# Altium schematic sheet mcu.SchDoc
size 762 x 508 mm; SheetNumber: 5; SheetTotal: 7
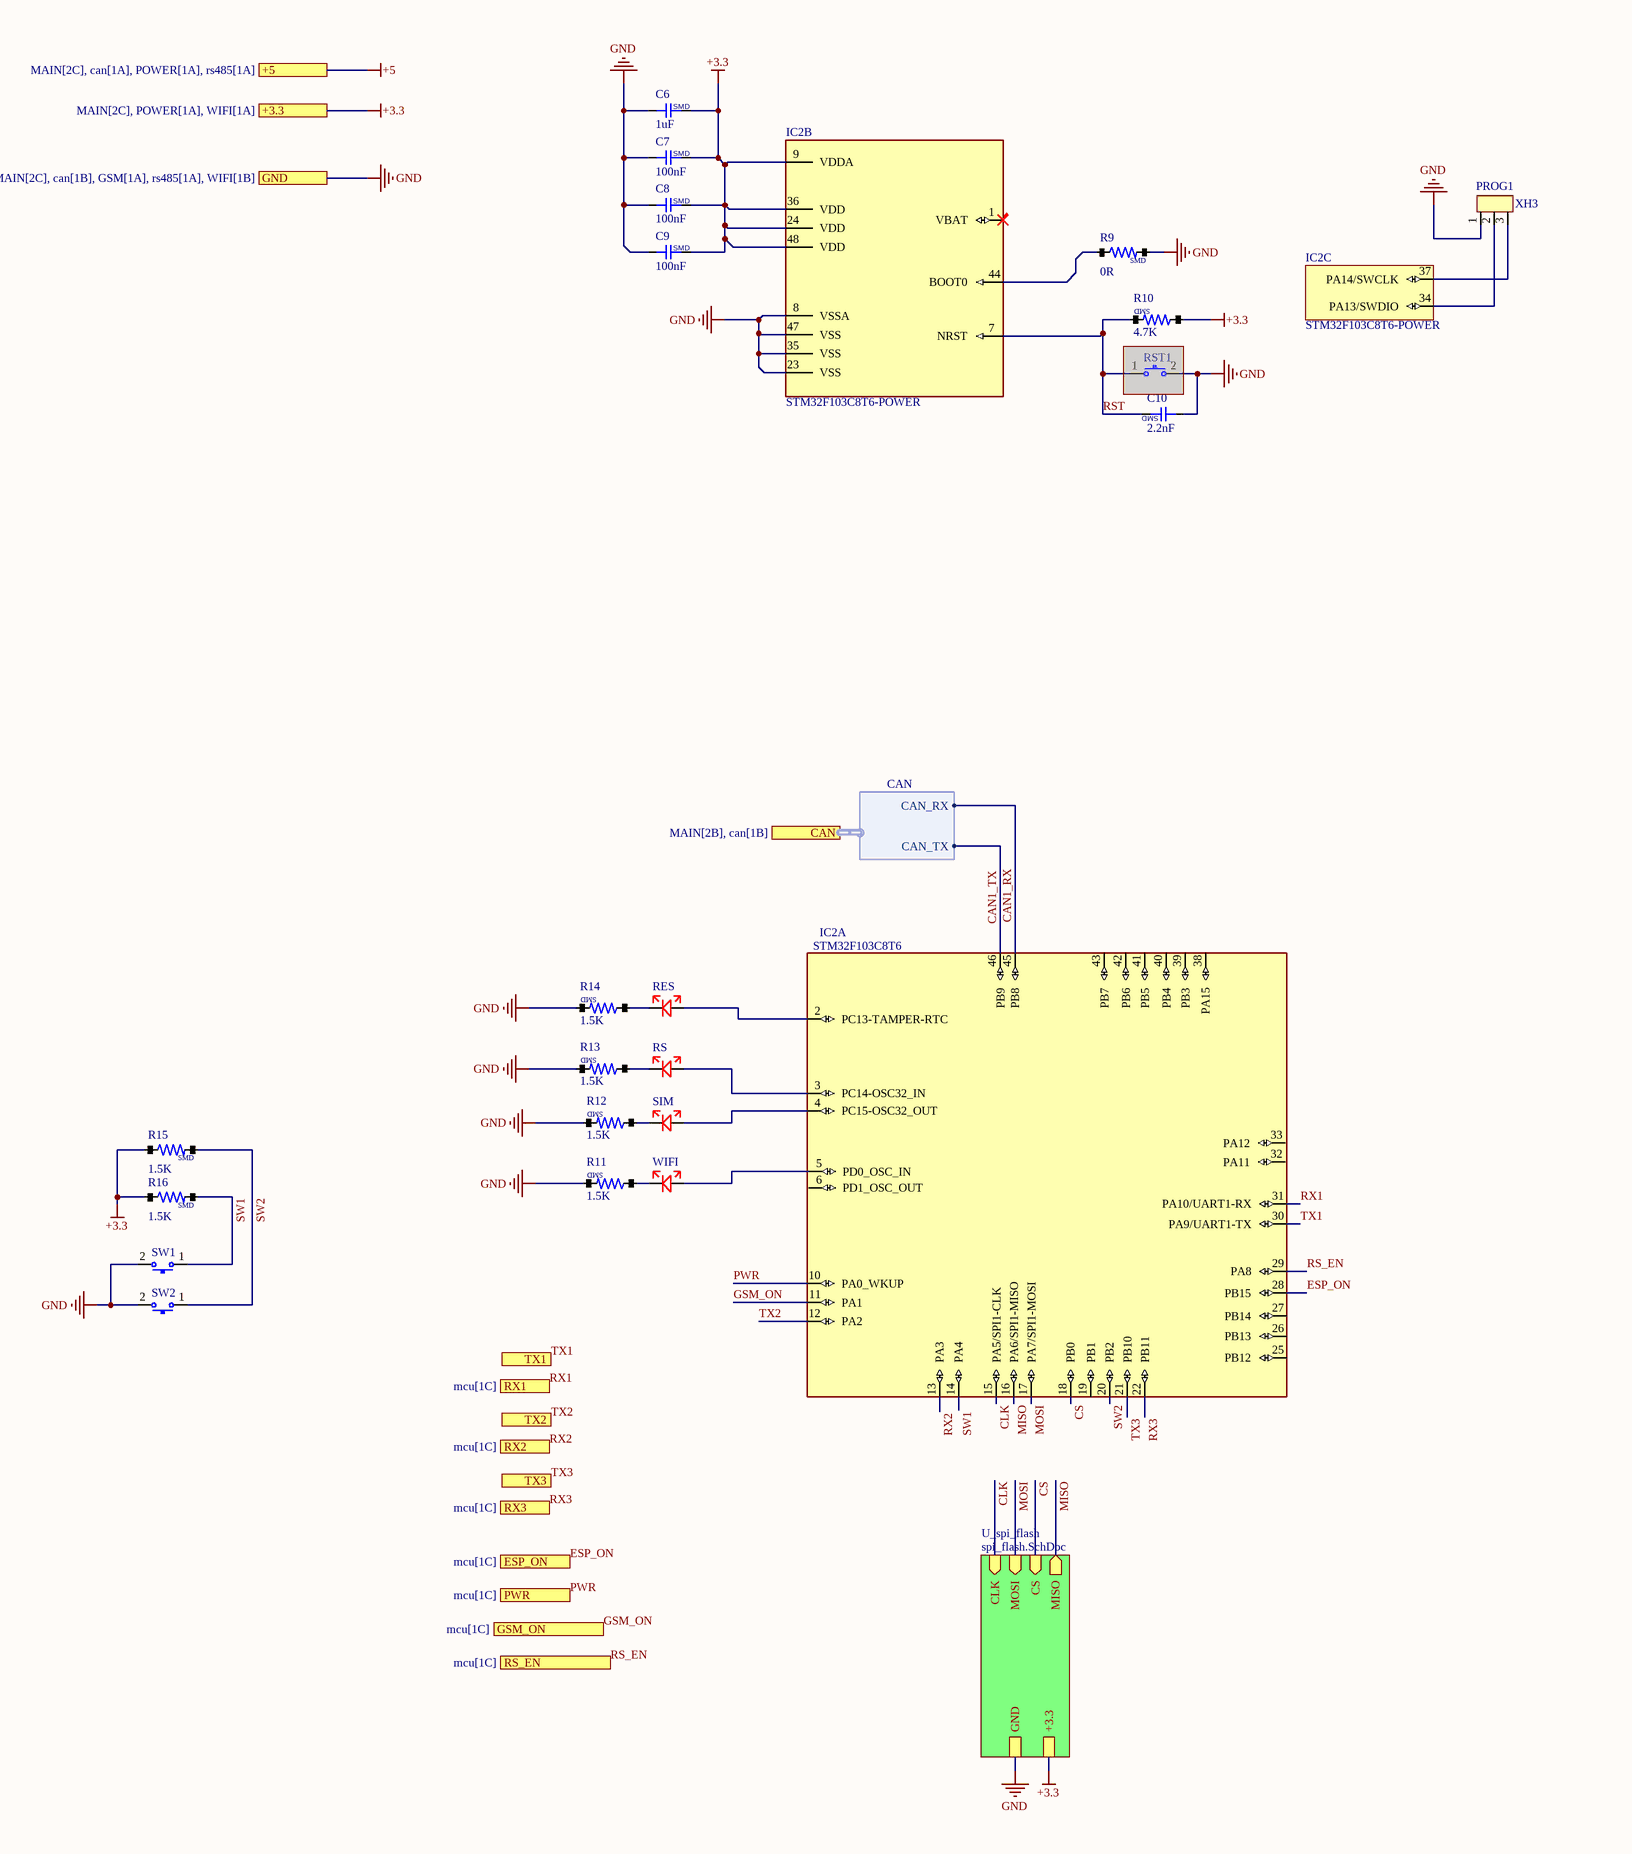
[diagram p0: mcu.SchDoc, left]

## Parts
C6  1uF  [CAP-0805]
C7  100nF  [CAP-0603]
C8  100nF  [CAP-0603]
C9  100nF  [CAP-0603]
C10  2.2nF  [CAP-0603]
IC2  STM32F103C8T6  [LQFP48-7x7-0.50]  (parts A,B,C of 3)
PROG1  XH3  [XH3]
R9  0R  [RES/0603]
R10  4.7K  [RES/0603]
R11  1.5K  [RES/0603]
R12  1.5K  [RES/0603]
R13  1.5K  [RES/0603]
R14  1.5K  [RES/0603]
R15  1.5K  [RES/0603]
R16  1.5K  [RES/0603]
RES  (no value)  [LED/0805]
RS  (no value)  [LED/0805]
RST1  (no value)  [micro-sw-little]  (masked out: inside a compile mask, not in the netlist)
SIM  (no value)  [LED/0805]
SW1  (no value)  [micro_switch_smd]
SW2  (no value)  [micro_switch_smd]
WIFI  (no value)  [LED/0805]

## Sub-sheets
U_spi_flash = spi_flash.SchDoc: GND, +3.3, CS (in), MISO (out), MOSI (in), CLK (in)

## Ports
+3.3 (see MAIN[2C], POWER[1A], WIFI[1A]), +5 (see MAIN[2C], can[1A], POWER[1A], rs485[1A]), CAN (harness CAN, see MAIN[2B], can[1B]), ESP_ON (out, see mcu[1C]), GND (see MAIN[2C], can[1B], GSM[1A], rs485[1A], WIFI[1B]), GSM_ON (out, see mcu[1C]), PWR (out, see mcu[1C]), RS_EN (out, see mcu[1C]), RX1 (in, see mcu[1C]), RX2 (in, see mcu[1C]), RX3 (in, see mcu[1C]), TX1 (out), TX2 (out), TX3 (out)

## Harnesses
CAN: CAN_RX, CAN_TX

## Nets
+3.3: C6.2 C7.2 C8.2 C9.2 IC2.9(VDDA) IC2.24(VDD) IC2.36(VDD) IC2.48(VDD) R10.1 R15.1 R16.1 ; port +3.3, sheet U_spi_flash/+3.3
+5: port +5
GND: C6.1 C7.1 C8.1 C9.1 C10.1 IC2.8(VSSA) IC2.23(VSS) IC2.35(VSS) IC2.47(VSS) PROG1.1 R9.2 R11.2 R12.2 R13.2 R14.2 SW1.2 SW2.2 ; port GND, sheet U_spi_flash/GND
CAN1_RX: IC2.45(PB8) ; port CAN.CAN_RX
CAN1_TX: IC2.46(PB9) ; port CAN.CAN_TX
CLK: IC2.15(PA5/SPI1-CLK) ; sheet U_spi_flash/CLK
CS: IC2.18(PB0) ; sheet U_spi_flash/CS
ESP_ON: IC2.28(PB15) ; port ESP_ON
GSM_ON: IC2.11(PA1) ; port GSM_ON
MISO: IC2.16(PA6/SPI1-MISO) ; sheet U_spi_flash/MISO
MOSI: IC2.17(PA7/SPI1-MOSI) ; sheet U_spi_flash/MOSI
PWR: IC2.10(PA0_WKUP) ; port PWR
RS_EN: IC2.29(PA8) ; port RS_EN
RST: C10.2 IC2.7(NRST) R10.2
RX1: IC2.31(PA10/UART1-RX) ; port RX1
RX2: IC2.13(PA3) ; port RX2
RX3: IC2.22(PB11) ; port RX3
SW1: IC2.14(PA4) R16.2 SW1.1
SW2: IC2.20(PB2) R15.2 SW2.1
TX1: IC2.30(PA9/UART1-TX) ; port TX1
TX2: IC2.12(PA2) ; port TX2
TX3: IC2.21(PB10) ; port TX3
NetIC2_2: IC2.2(PC13-TAMPER-RTC) RES.A
NetIC2_3: IC2.3(PC14-OSC32_IN) RS.A
NetIC2_4: IC2.4(PC15-OSC32_OUT) SIM.A
NetIC2_5: IC2.5(PD0_OSC_IN) WIFI.A
NetIC2_34: IC2.34(PA13/SWDIO) PROG1.2
NetIC2_37: IC2.37(PA14/SWCLK) PROG1.3
NetIC2_44: IC2.44(BOOT0) R9.1
NetR11_1: R11.1 WIFI.K
NetR12_1: R12.1 SIM.K
NetR13_1: R13.1 RS.K
NetR14_1: R14.1 RES.K

Not connected (* = marked no-connect by the designer): IC2 1(VBAT)* 6(PD1_OSC_OUT) 19(PB1) 25(PB12) 26(PB13) 27(PB14) 32(PA11) 33(PA12) 38(PA15) 39(PB3) 40(PB4) 41(PB5) 42(PB6) 43(PB7)

## Layout directives
net class IC: (no net found under the mark)

## Notes on the sheet
- (in symbol cap_smd) SMD
- (in symbol RES/SMD) SMD

## Library data of the parts
C6-C10 = cap_smd
R9-R16 = RES/SMD
RES RS SIM WIFI = LED-1COLER
RST1 SW1 SW2 = micro_sw